# Altium schematic sheet TEMP_SCH.SchDoc
size A
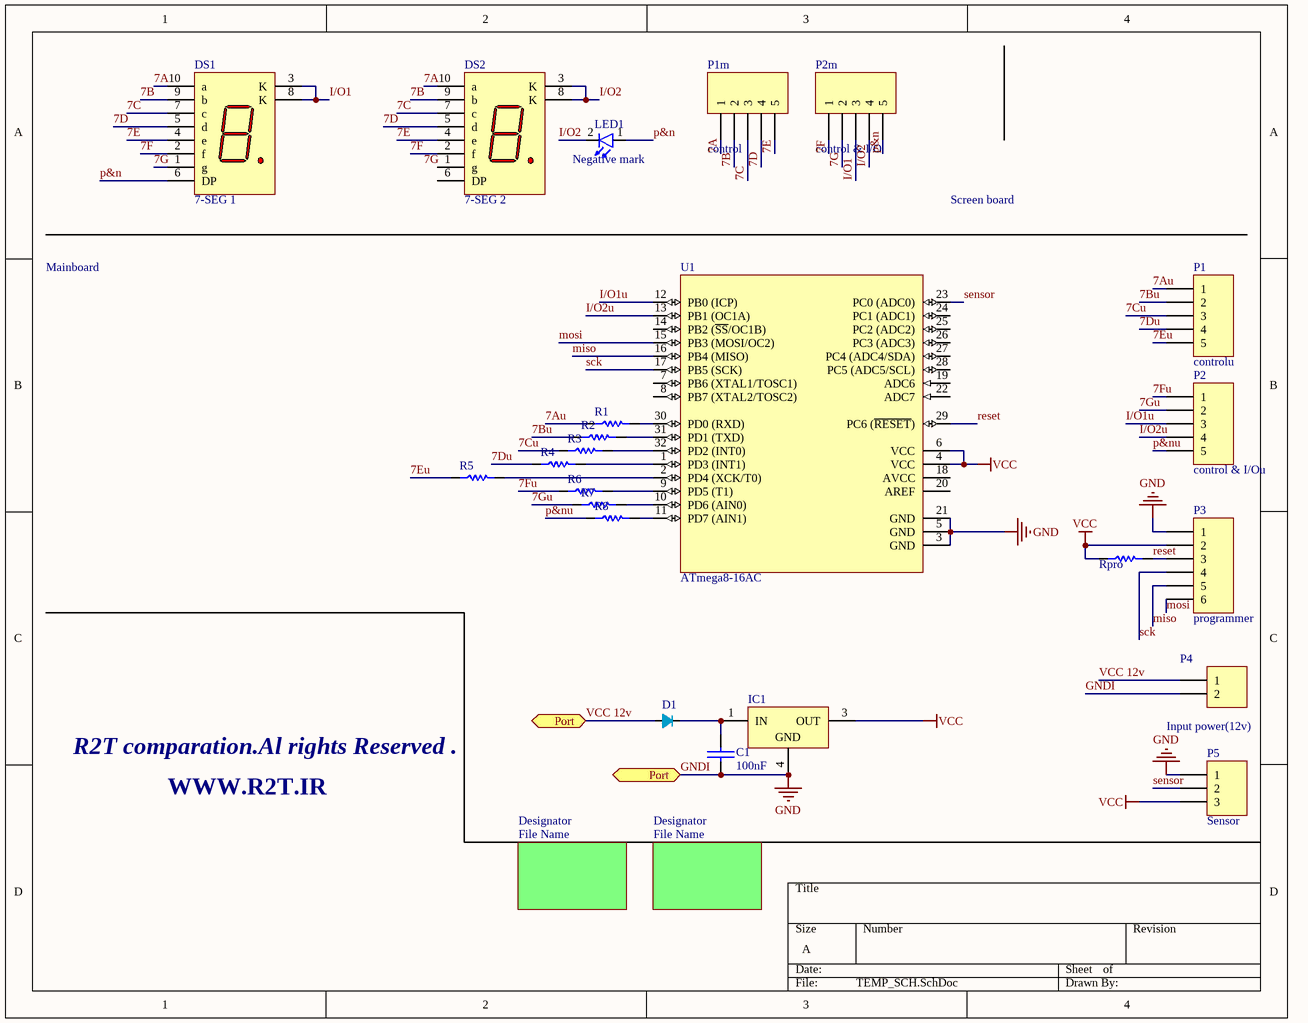
[diagram p0: TEMP_SCH.SchDoc]

## Parts
C1  100nF  [SMD_CAP_1206]
D1  SMD Diodes  [DO-214AC ( SMD Diode )]  (value not drawn)
DS1  7-SEG 1  [F-10]
DS2  7-SEG 2  [F-10]
IC1  L78M05  [TO-252]  (value not drawn)
LED1  Negative mark  [LED SMD 1206]
P1  controlu  [HDR1X5]
P1m  control  [HDR1X5]
P2  control & I/Ou  [HDR1X5]
P2m  control & I/O  [HDR1X5]
P3  programmer  [HDR1X6]
P4  Input power(12v)  [HDR1X2]
P5  Sensor  [HDR1X3]
R1  330  [RES 0805 (2012X06L)]  (value not drawn)
R2  330  [RES 0805 (2012X06L)]  (value not drawn)
R3  330  [RES 0805 (2012X06L)]  (value not drawn)
R4  330  [RES 0805 (2012X06L)]  (value not drawn)
R5  330  [RES 0805 (2012X06L)]  (value not drawn)
R6  330  [RES 0805 (2012X06L)]  (value not drawn)
R7  330  [RES 0805 (2012X06L)]  (value not drawn)
R8  330  [RES 0805 (2012X06L)]  (value not drawn)
Rpro  1K  [RES 0805 (2012X06L)]  (value not drawn)
U1  ATmega8-16AC  [32A_N]

## Sub-sheets
Designator = File Name: no entries
Designator = File Name: no entries

## Ports
Port

## Nets
GNDI: C1.2(-) D1.0 IC1.4(GND) P3.1 P4.1 P4.2 P5.1 U1.3(GND) U1.5(GND) U1.21(GND) ; port Port  [also labelled GND, VCC 12v]
VCC: IC1.3(OUT) P3.2 P5.3 Rpro.1 U1.4(VCC) U1.6(VCC)
7A: DS1.10(a) DS2.10(a) P1m.1
7Au: P1.1 R1.1
7B: DS1.9(b) DS2.9(b) P1m.2
7Bu: P1.2 R2.1
7C: DS1.7(c) DS2.7(c) P1m.3
7Cu: P1.3 R3.1
7D: DS1.5(d) DS2.5(d) P1m.4
7Du: P1.4 R4.1
7E: DS1.4(e) DS2.4(e) P1m.5
7Eu: P1.5 R5.1
7F: DS1.2(f) DS2.2(f) P2m.1
7Fu: P2.1 R6.1
7G: DS1.1(g) P2m.2
7Gu: P2.2 R7.1
I/O1: DS1.3(K) DS1.8(K) P2m.3
I/O1u: P2.3 U1.12(PB0_(ICP))
I/O2: DS2.3(K) DS2.8(K) LED1.2(K) P2m.4
I/O2u: P2.4 U1.13(PB1_(OC1A))
miso: P3.5 U1.16(PB4_(MISO))
mosi: P3.6 U1.15(PB3_(MOSI/OC2))
p&n: DS1.6(DP) LED1.1(A) P2m.5
p&nu: P2.5 R8.1
reset: P3.3 Rpro.2 U1.29(PC6_(~{RESET}))
sck: P3.4 U1.17(PB5_(SCK))
sensor: P5.2 U1.23(PC0_(ADC0))
NetC1_1: C1.1(+) D1.1 IC1.1(IN)
NetR1_2: R1.2 U1.30(PD0_(RXD))
NetR2_2: R2.2 U1.31(PD1_(TXD))
NetR3_2: R3.2 U1.32(PD2_(INT0))
NetR4_2: R4.2 U1.1(PD3_(INT1))
NetR5_2: R5.2 U1.2(PD4_(XCK/T0))
NetR6_2: R6.2 U1.9(PD5_(T1))
NetR7_2: R7.2 U1.10(PD6_(AIN0))
NetR8_2: R8.2 U1.11(PD7_(AIN1))

Not connected (* = marked no-connect by the designer): DS2 1(g) 6(DP); U1 7(PB6_(XTAL1/TOSC1)) 8(PB7_(XTAL2/TOSC2)) 14(PB2_(~{SS}/OC1B)) 18(AVCC) 19(ADC6) 20(AREF) 22(ADC7) 24(PC1_(ADC1)) 25(PC2_(ADC2)) 26(PC3_(ADC3)) 27(PC4_(ADC4/SDA)) 28(PC5_(ADC5/SCL))

## Notes on the sheet
- Screen board
- Mainboard
- R2T comparation.Al rights Reserved .
- WWW.R2T.IR
- Labels drawn without touching a wire or pin: 7G

## Library data of the parts
C1 = Cap-Bipolar: Bipolar Capacitor; Voltage: 100V; Designer: Saeid Jorablo; Organazation: ControTec; Adding Date: 1387/12/20; Value: 100nF
D1 = SMD Diodes: Designer :: Hamed Jafarzadeh
DS1 DS2 = HDSP-303E: 10 mm Slim Font, HER 7-Segment Display: CC, RH DP; Published: 26-May-2004; LatestRevisionDate: 11-Oct-2004; LatestRevisionNote: Display outline superimposed on PCB Footprint.; DatasheetVersion: 1-Oct-2001; PackageVersion: 17-Jan-2002; PackageReference: F-10; Publisher: Altium Limited; PackageDescription: LED, 7-Segment Display, 10 mm, RHD; 10 Leads; Row Space 7.62 mm; Pitch 2.54 mm; ComponentLink1Description: Manufacturer Link; ComponentLink1URL: http://www.avagotech.com/; ComponentLink2Description: Datasheet; ComponentLink2URL: http://cp.literature.agilent.com/litweb/pdf/5988-4352EN.pdf
IC1 = L78M05: Precision 500mA Regulator
LED1 = LED: Designer: Saeid Jorablo; Organazation: ControTec; Color: Red; Adding Date: 1387/12/22; Size: SMD 1206
P1 P1m P2 P2m = Header 5: Header, 5-Pin; LatestRevisionDate: 17-Jul-2002; LatestRevisionNote: Re-released for DXP Platform.; Publisher: Altium Limited
P3 = Header 6: Header, 6-Pin; LatestRevisionDate: 17-Jul-2002; LatestRevisionNote: Re-released for DXP Platform.; Publisher: Altium Limited
P4 = Header 2: Header, 2-Pin; LatestRevisionDate: 17-Jul-2002; LatestRevisionNote: Re-released for DXP Platform.; Publisher: Altium Limited
P5 = Header 3: Header, 3-Pin; LatestRevisionDate: 17-Jul-2002; LatestRevisionNote: Re-released for DXP Platform.; Publisher: Altium Limited
R1-R8 Rpro = Resistor: Tolerance: 5%; Power: 1/8 W
  R1-R8: Value: 330
  Rpro: Value: 1K
U1 = ATmega8-16AC: 8-Bit AVR Microcontroller with 8K Bytes of In-System Programmable Flash Memory; Published: 17-Sep-2003; LatestRevisionDate: 13-Apr-2006; LatestRevisionNote: IPC-7351 Footprint Added.; DatasheetVersion: 2486H-AVR-09/02; PackageVersion: revB, Oct-2001; PackageReference: 32A; Publisher: Altium Limited; PackageDescription: 32-Pin Thin Quad Flat Pack 0.8 mm Pitch; Code_JEDEC: MS-026-ABA; ComponentLink1Description: Manufacturer Link; ComponentLink1URL: http://www.atmel.com; ComponentLink2Description: Datasheet; ComponentLink2URL: http://www.atmel.com/dyn/resources/prod_documents/doc2486.pdf